# EAGLE design photonAlarm5 (EAGLE 7.5.0)
CNAME: photon
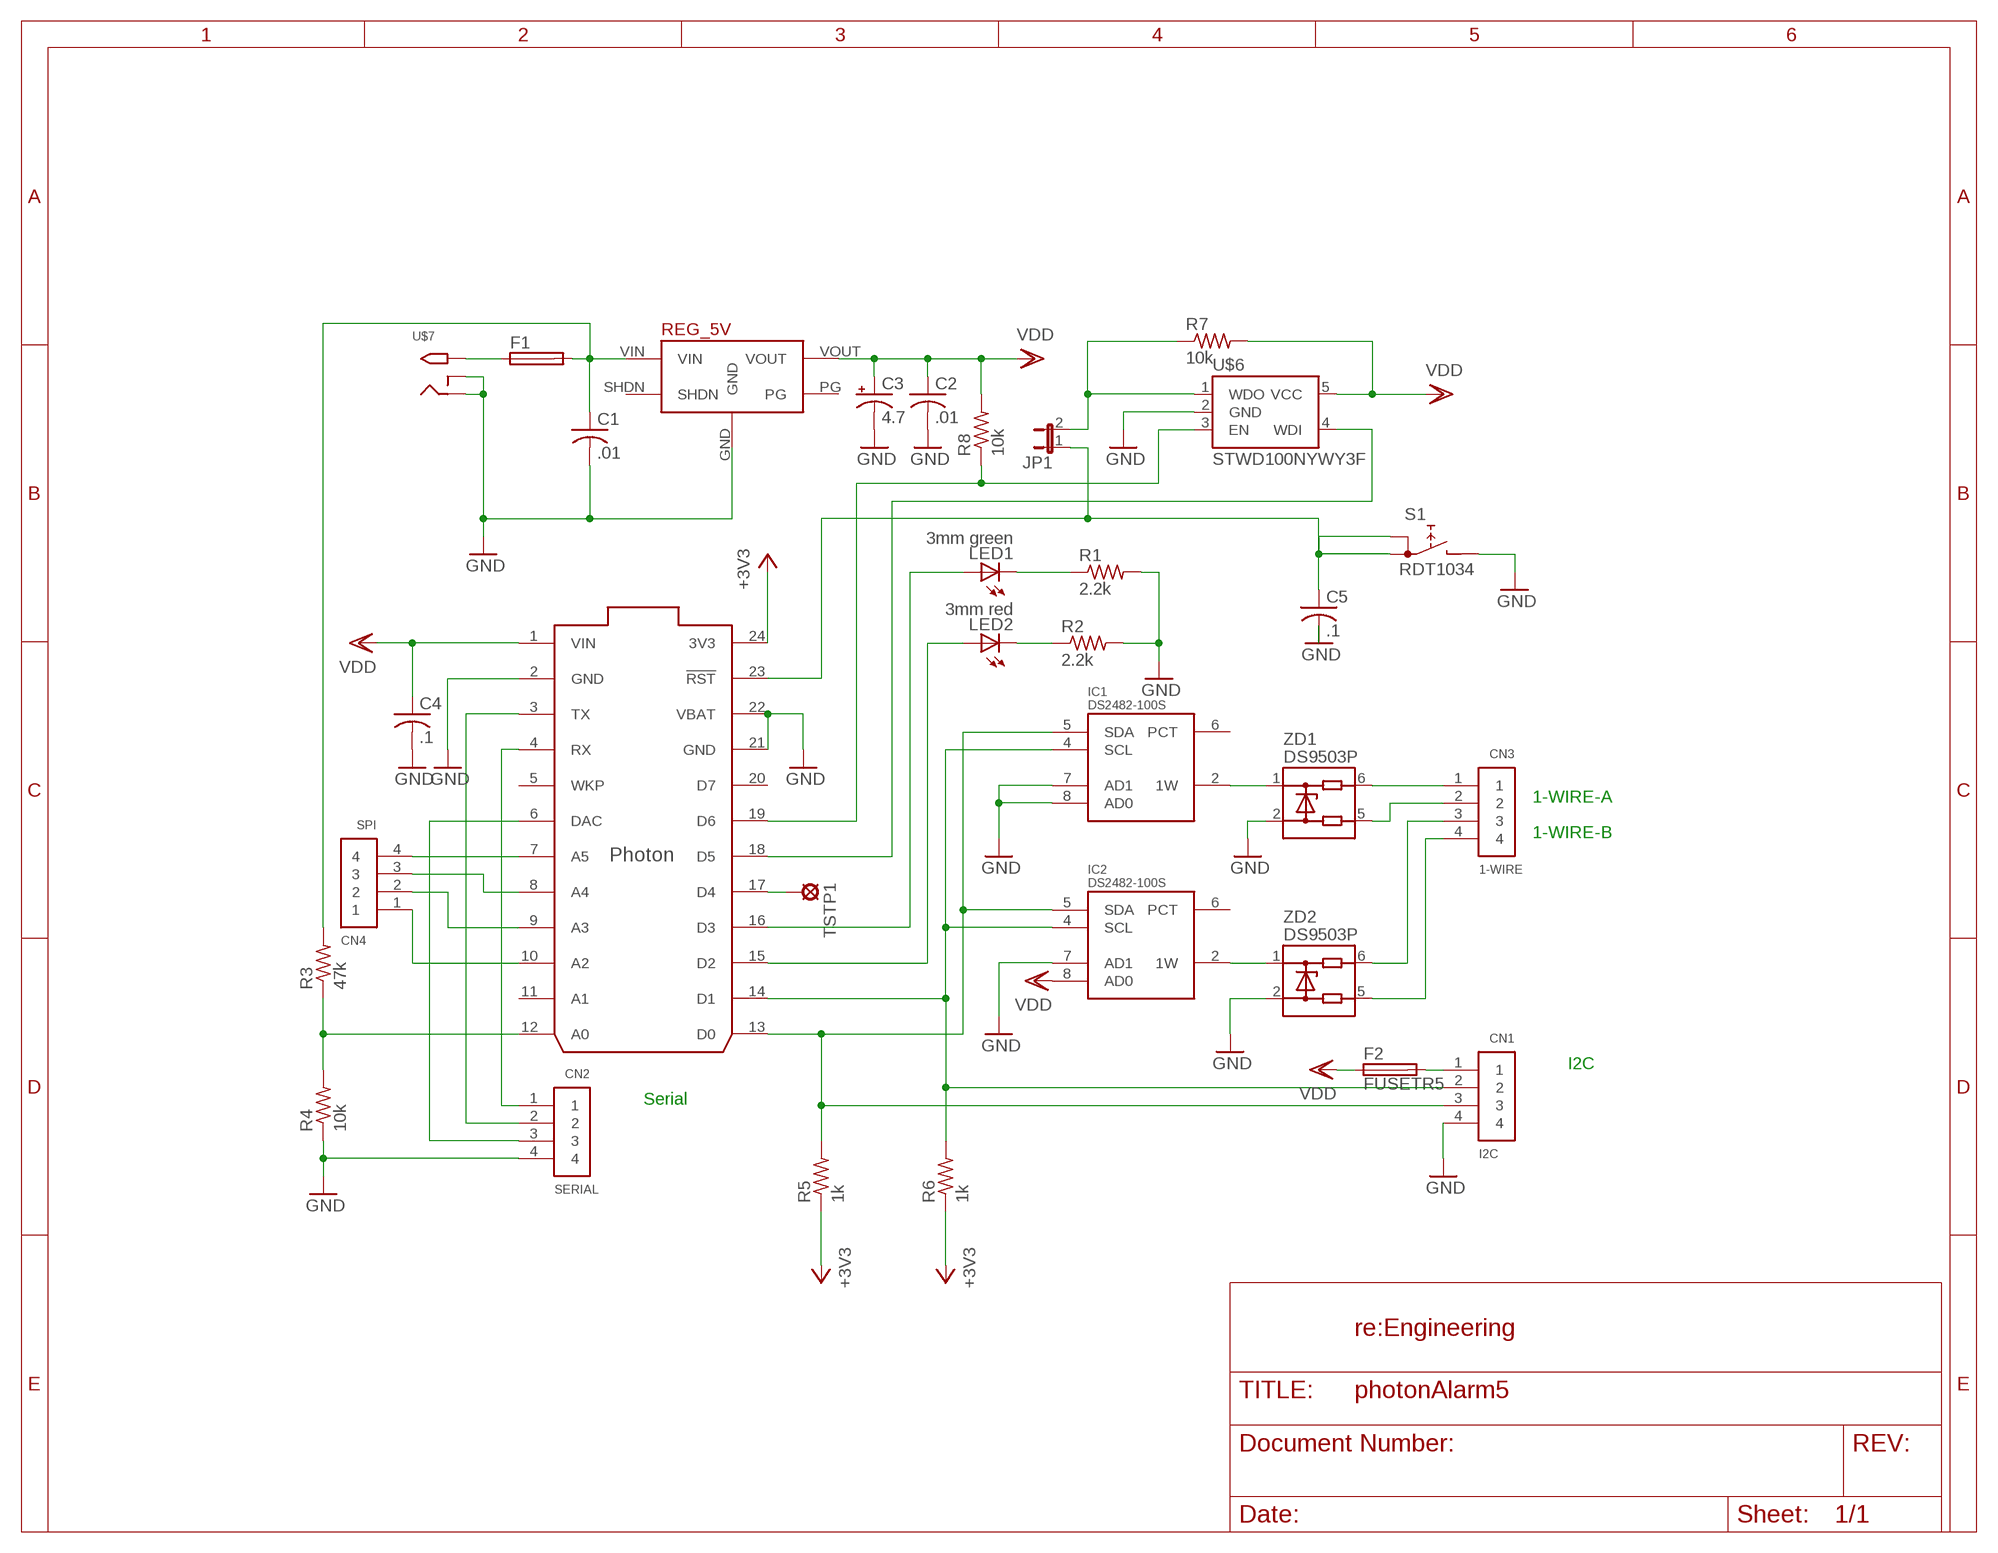
[diagram p0: schematic, sheet 1]

## Parts
C1  .01  C-USC0805  [C0805]
C2  .01  C-USC0805  [C0805]
C3  4.7  CPOL-USE2,5-6E  [E2,5-6E]
C4  .1  C-USC0805  [C0805]
C5  .1  C-USC0805  [C0805]
CN1  I2C  1X4-BIG  [1X04-BIG]
CN2  SERIAL  1X4-BIG  [1X04-BIG]
CN3  1-WIRE  1X4-BIG  [1X04-BIG]
CN4  SPI  1X4-BIG  [1X04-BIG]
F1  PICOFUSE  [PICOFUSE]
F2  FUSETR5  [TR5]
IC1  DS2482-100S  [SO08]
IC2  DS2482-100S  [SO08]
JP1  JP1E  [JP1]
LED1  3mm green  LED5MM  [LED5MM]
LED2  3mm red  LED5MM  [LED5MM]
R1  2.2k  R-US_R1206  [R1206]
R2  2.2k  R-US_R1206  [R1206]
R3  47k  R-US_R1206  [R1206]
R4  10k  R-US_R1206  [R1206]
R5  1k  R-US_R1206  [R1206]
R6  1k  R-US_R1206  [R1206]
R7  10k  R-US_R1206  [R1206]
R8  10k  R-US_R1206  [R1206]
REG_5V  5V_D24V10FAD24V10F5MIR  [5V_D24V10F5]
S1  RDT1034  [RDT1034]
TSTP1  LSP10  [LSP10]
U$1  PHOTON_WITH_HEADERS  [PHOTON]
U$6  STWD100NYWY3F  [SOT23-5]
U$7  2.1MMJACKSMT  [DCJACK_2MM_SMT]
ZD1  DS9503P  [TSOC6]
ZD2  DS9503P  [TSOC6]

## Nets
+3V3: R5.1 R6.1 U$1.24(3V3)
GND: C1.2 C2.2 C3.- C4.2 C5.2 CN1.4 CN2.4 IC1.7(AD1) IC1.8(AD0) IC2.7(AD1) R1.2 R2.2 R4.1 REG_5V.GND S1.B U$1.2(GND) U$1.21(GND) U$1.22(VBAT) U$6.2(GND) U$7.GND(RING) U$7.GNDBREAK(RING_SW) ZD1.2 ZD2.2
N$1: TSTP1.MP U$1.17(D4)
N$2: CN1.2 IC1.4(SCL) IC2.4(SCL) R6.2 U$1.14(D1)
N$3: LED1.K(C) R1.1
N$4: LED2.K(C) R2.1
N$5: LED1.A U$1.16(D3)
N$6: LED2.A U$1.15(D2)
N$7: CN1.3 IC1.5(SDA) IC2.5(SDA) R5.2 U$1.13(D0)
N$8: IC1.2(1W) ZD1.1
N$10: R3.1 R4.2 U$1.12(A0)
N$11: IC2.2(1W) ZD2.1
N$12: CN3.3 ZD2.6
N$13: CN3.4 ZD2.5
N$14: CN3.2 ZD1.5
N$15: CN3.1 ZD1.6
N$16: CN2.1 U$1.4(RX)
N$17: CN2.2 U$1.3(TX)
N$18: CN2.3 U$1.6(DAC)
N$20: U$1.18(D5) U$6.4(WDI)
N$21: R8.1 U$1.19(D6) U$6.3(EN)
N$22: CN1.1 F2.2
N$23: CN4.4 U$1.7(A5)
N$24: CN4.3 U$1.8(A4)
N$25: F1.1 U$7.PWR2(TIP)
N$26: CN4.2 U$1.9(A3)
N$27: CN4.1 U$1.10(A2)
N$28: JP1.2 R7.1 U$6.1(WDO)
RST: C5.1 JP1.1 S1.A S1.A1 U$1.23(!RST)
VDD: C2.1 C3.+ C4.1 F2.1 IC2.8(AD0) R7.2 R8.2 REG_5V.VOUT U$1.1(VIN) U$6.5(VCC)
VIN: C1.1 F1.2 R3.2 REG_5V.VIN
Unconnected: IC1.6(PCT) IC2.6(PCT) REG_5V.PG REG_5V.SHDN U$1.5(WKP) U$1.11(A1) U$1.20(D7)

## Notes on the sheet
- 1-WIRE-A
- 1-WIRE-B
- I2C
- Serial
- re:Engineering

## Power pins joined to a net without a drawn wire
GND: IC1.3(GND) IC2.3(GND)
VDD: IC1.1(VDD) IC2.1(VDD)

## Library data of the parts
C1 C2 C4 C5 = adafruit:C-US: CAPACITOR, American symbol
C3 = rcl:CPOL-US: POLARIZED CAPACITOR, American symbol
CN1-CN4 = adafruit:1X4: 4-pin connector
F1 = dont:PICOFUSE: PICOFUSE 19275, Wickmann; OC_FARNELL: unknown; OC_NEWARK: unknown
F2 = fuse:FUSE: Fuse; OC_FARNELL: unknown; OC_NEWARK: unknown
IC1 IC2 = 1wire:DS2482-100: I2C to 1-Wire Host Adapter/Line Driver This device is a onewire host and I2C interface in one chip. It provides the complete DC/AC requirements for onewire communication, including overdrive speed mode, but, unlike the DS2480B chip, no 12V EPROM programming. Notes: For overdrive speed and 5V EEPROM programming, an external active pullup circuit must be connected to the 1W, VDD and PCT pin. See the datasheet for details. The lower two I2C adress bits of the chip can be selected by external pins, so up to 4 chips may be connected to the same I2C bus. Author: Orginal device and description from Giovanni Varasano <giovanni.varasano@fastwebnet.it> Improved by Jan Kandziora <jjj@gmx.de>
JP1 = jumper:JP1E: JUMPER
LED1 LED2 = adafruit:LED: LED OSRAM: - CHIPLED LG R971, LG N971, LY N971, LG Q971, LY Q971, LO R971, LY R971 LH N974, LH R974 LS Q976, LO Q976, LY Q976 LO Q996 - Hyper CHIPLED LW Q18S LB Q993, LB Q99A, LB R99A - SideLED LS A670, LO A670, LY A670, LG A670, LP A670 LB A673, LV A673, LT A673, LW A673 LH A674 LY A675 LS A676, LA A676, LO A676, LY A676, LW A676 LS A679, LY A679, LG A679 - Hyper Micro SIDELED® LS Y876, LA Y876, LO Y876, LY Y876 LT Y87S - SmartLED LW L88C, LW L88S LB L89C, LB L89S, LG L890 LS L89K, LO L89K, LY L89K LS L896, LA L896, LO L896, LY L896 - TOPLED LS T670, LO T670, LY T670, LG T670, LP T670 LSG T670, LSP T670, LSY T670, LOP T670, LYG T670 LG T671, LOG T671, LSG T671 LB T673, LV T673, LT T673, LW T673 LH T674 LS T676, LA T676, LO T676, LY T676, LB T676, LH T676, LSB T676, LW T676 LB T67C, LV T67C, LT T67C, LS T67K, LO T67K, LY T67K, LW E67C LS E67B, LA E67B, LO E67B, LY E67B, LB E67C, LV E67C, LT E67C LW T67C LS T679, LY T679, LG T679 LS T770, LO T770, LY T770, LG T770, LP T770 LB T773, LV T773, LT T773, LW T773 LH T774 LS E675, LA E675, LY E675, LS T675 LS T776, LA T776, LO T776, LY T776, LB T776 LHGB T686 LT T68C, LB T68C - Hyper Mini TOPLED® LB M676 - Mini TOPLED Santana® LG M470 LS M47K, LO M47K, LY M47K Source: http://www.osram.convergy.de/
R1-R8 = resistor:R-US_: RESISTOR, American symbol
REG_5V = reEng:5V_D24V10FA
S1 = switch:RDT1034: PUSH SWITCH www.radiohm.com
TSTP1 = solpad:LSP10: SOLDER PAD drill 1.0 mm, distributor Buerklin, 12H555
U$1 = Spark:PHOTON
U$6 = reEng:STWD100NYWY3F: STD100 STWD100NYWY3F Watchdog Timer
U$7 = adafruit:2.1MMJACK: 2.1mm x 5.5mm THM DC jack with internal switch. Digikey part #PJ-102A, 4UCON part #05537 2.1mm x 5.5mm SMT DC jack with internal switch. Digikey part #PJ-002A-SMT, 4UCON part #03267 By microbuilder.eu & adafruit.com
ZD1 ZD2 = 1wire:DS9503: ESD Protection Diode with Resistors This ESD protection diode is designed especially for onewire host interfaces. Unlike the DS9502, it has two additional 5Ohm resitors in the 1W and GND line. Pin 5 and 6 have to be connected to the host side, pin 1 und 2 to the network side. The 1W line is through pin 1 and 6, the GND line is through pin 2 and 5. Author: Jan Kandziora <jjj@gmx.de>

## Board
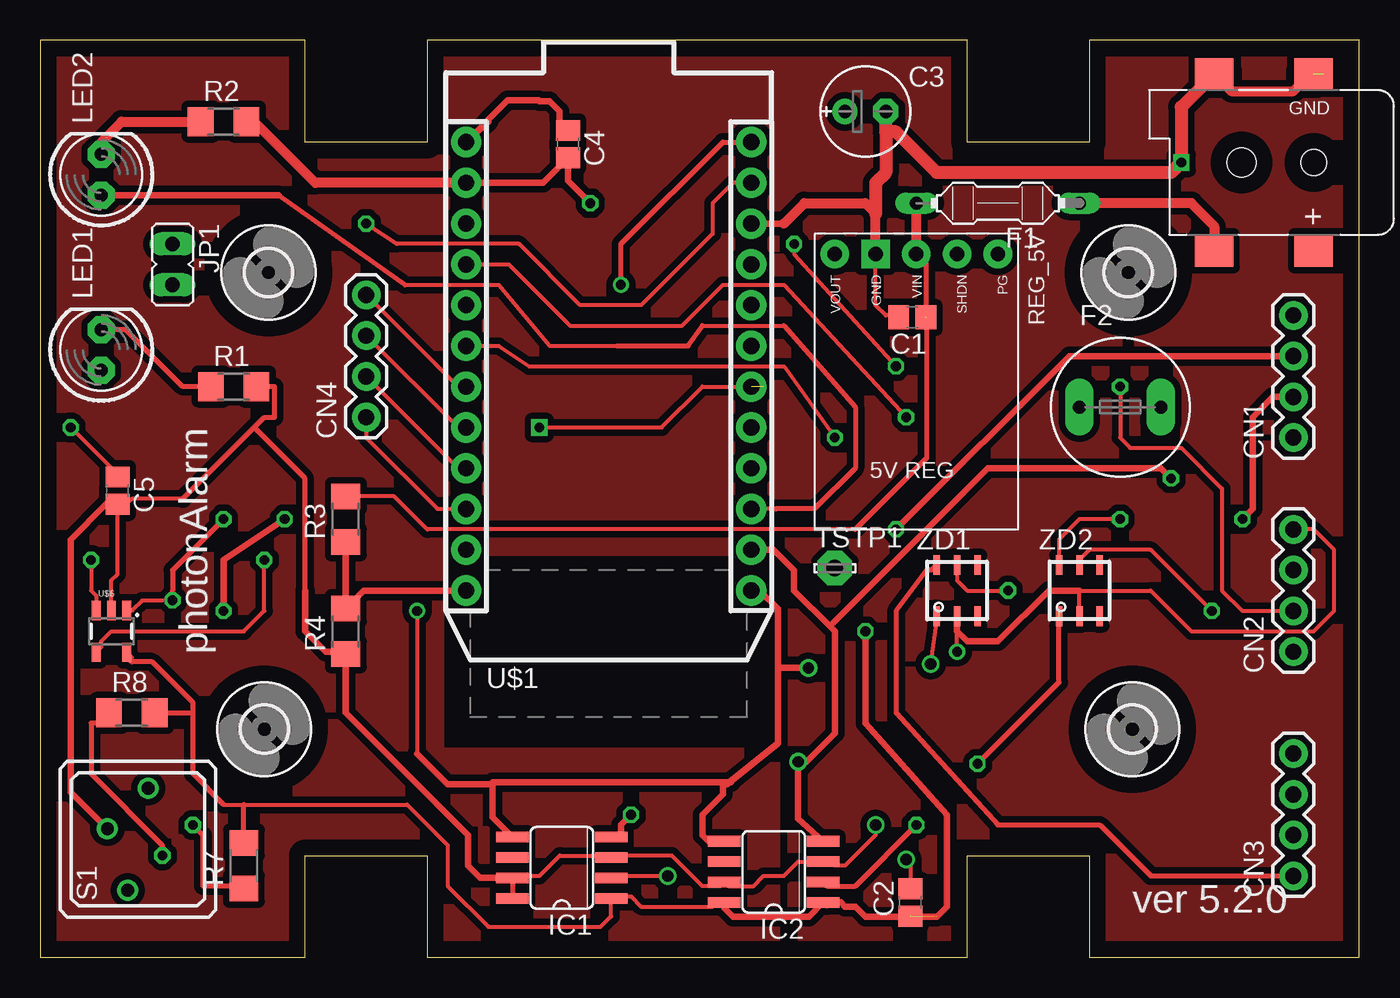
[diagram p1: board, top side]
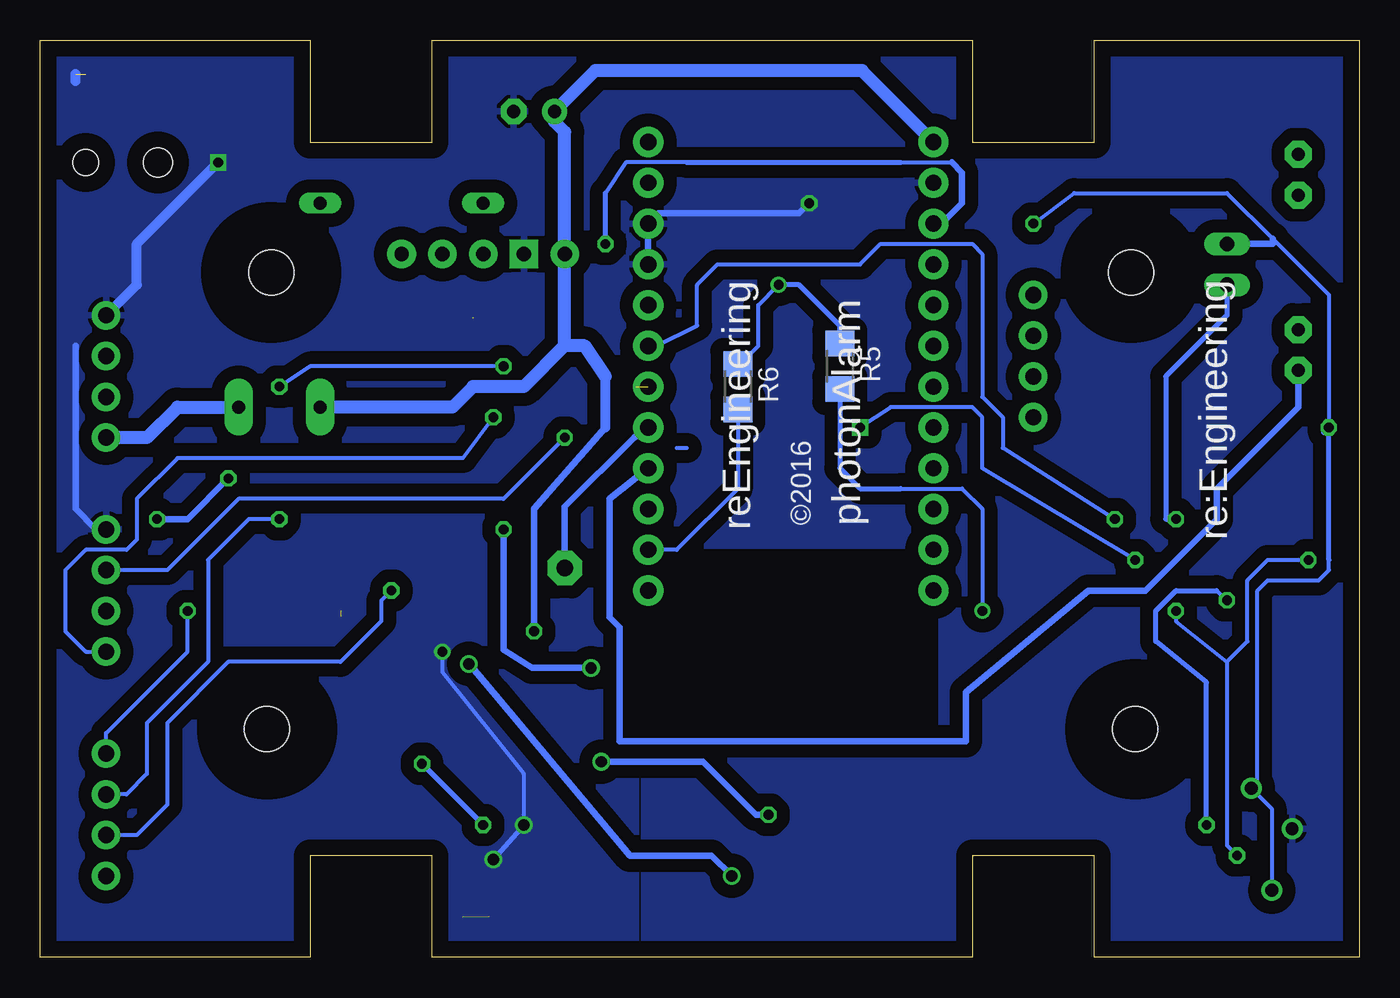
[diagram p2: board, bottom side, seen from below]

Size 82.22 x 57.15 mm. Coordinates in mm from the lower left corner, seen from the top.
Outline: 0,0 16.51,0 16.51,6.35 24.13,6.35 24.13,0 57.78,0 57.78,6.35 65.41,6.35 65.41,0 82.22,0 82.22,57.14 65.41,57.14 65.41,50.8 57.78,50.8 57.78,57.15 24.13,57.15 24.13,50.8 16.51,50.8 16.51,57.14 0,57.14 0,0
Copper layers (1*16): Top 0.035mm / dielectric 1.5mm / Bottom 0.035mm
Design rules "default *": minimum track width 10mil, minimum drill 12mil, track to track 8mil, track to pad 8mil, pad to pad 8mil, via to via 8mil, smd to smd 8mil, copper to edge 40mil, drill to drill 8mil, minimum pad ring 10mil, minimum via ring 8mil, stop-mask expansion 4mil, vias tented up to drill 0mil, thermal gap 10mil

### Footprints (pad centres in the part's own frame; a part is rotated, then mirrored left to right if it is on the bottom)
C0805 = smd 1.3 x 1.5: 1 -0.85,0; 2 0.85,0
E2,5-6E = drill 0.813 pad 1.575: + -1.27,0 | drill 0.813 pad 1.575 octagon: - 1.27,0
1X04-BIG = drill 1.016 pad 1.778: 1 0,0; 2 2.54,0; 3 5.08,0; 4 7.62,0
PICOFUSE = drill 0.813 long: 1 -5.08,0; 2 5.08,0
TR5 = drill 0.813 pad 1.778 long: 1 -2.54,0; 2 2.54,0
SO08 = smd 0.66 x 2.032: 1 -1.905,-3.073; 2 -0.635,-3.073; 3 0.635,-3.073; 4 1.905,-3.073; 5 1.905,3.073; 6 0.635,3.073; 7 -0.635,3.073; 8 -1.905,3.073
JP1 = drill 0.914 long: 1 0,-1.27; 2 0,1.27
LED5MM = drill 0.813 pad 1.676 octagon: A -1.27,0; K 1.27,0
R1206 = smd 1.6 x 1.803: 1 -1.422,0; 2 1.422,0
5V_D24V10F5 = drill 0.9 pad 1.778 square: GND 2.54,-10.16 | drill 0.9 pad 1.778: PG -5.08,-10.16; SHDN -2.54,-10.16; VIN 0,-10.16; VOUT 5.08,-10.16
RDT1034 = drill 0.8: A 3.175,-0.635; A1 -3.175,0.635; B 0.65,1.9
LSP10 = drill 1.016 pad 2.159 octagon: MP 0,0
PHOTON = drill 1.016 pad 1.88: 1 1.27,32.258; 2 1.27,29.718; 3 1.27,27.178; 4 1.27,24.638; 5 1.27,22.098; 6 1.27,19.558; 7 1.27,17.018; 8 1.27,14.478; 9 1.27,11.938; 10 1.27,9.398; 11 1.27,6.858; 12 1.27,4.318; 13 19.05,4.318; 14 19.05,6.858; 15 19.05,9.398; 16 19.05,11.938; 17 19.05,14.478; 18 19.05,17.018; 19 19.05,19.558; 20 19.05,22.098; 21 19.05,24.638; 22 19.05,27.178; 23 19.05,29.718; 24 19.05,32.258
2,8 = hole 2.8: 0,0
SOT23-5 = smd 0.55 x 1.2: 1 0.95,1.3; 2 0,1.3; 3 -0.95,1.3; 4 -0.95,-1.3; 5 0.95,-1.3
DCJACK_2MM_SMT = smd 2.4 x 2: GND 0,-5.5; GNDBREAK 6.2,-5.5; PWR1 0,5.5; PWR2 6.2,5.5 | hole 1.6: 0,0 | hole 1.8: 4.5,0
TSOC6 = smd 0.406 x 1.219: 1 -1.27,-1.6; 2 0,-1.6; 3 1.27,-1.6; 4 1.27,1.6; 5 0,1.6; 6 -1.27,1.6

### Placement (x,y rotation side)
C1  54.36,39.88 180 top
C2  54.23,3.43 90 top
C3  51.44,52.7 0 top
C4  32.89,50.67 270 top
C5  4.83,29.08 270 top
CN1  78.11,32.38 90 top
CN2  78.11,19.05 90 top
CN3  78.11,5.08 90 top
CN4  20.32,33.66 90 top
F1  59.69,46.99 180 top
F2  67.31,34.29 0 top
IC1  32.51,5.59 90 top
IC2  45.72,5.33 90 top
JP1  8.26,43.18 180 top
LED1  3.81,37.85 90 top
LED2  3.81,48.77 90 top
R1  12.06,35.56 0 top
R2  11.43,52.07 0 top
R3  19.05,27.3 90 top
R4  19.05,20.32 90 top
R5  32.38,36.83 270 bottom
R6  38.73,35.56 270 bottom
R7  12.7,5.71 90 top
R8  5.71,15.24 0 top
REG_5V  54.61,33.66 180 top
S1  6.1,7.37 90 top
TSTP1  49.53,24.26 0 top
U$1  25.27,18.54 0 top
U$2  [2,8]  14.22,42.67 0 top
U$3  [2,8]  13.97,14.22 0 top
U$4  [2,8]  67.82,42.67 0 top
U$5  [2,8]  68.07,14.22 0 top
U$6  4.45,20.32 0 top
U$7  79.38,49.53 180 top
ZD1  57.15,22.86 0 top
ZD2  64.77,22.86 0 top

### Tracks (layer width: path | path; a pad name or v marks a point on that pad's centre or on a via)
+3V3  (via drill 0.6)
  Top 0.305: v36.2,41.91 36.2,44.45 42.55,50.8 U$1.24
  Bottom 0.254: R6.1 38.73,36.83 37.47,38.1 37.47,40.64 v36.2,41.91
  Bottom 0.305: R5.1 32.38,39.37 34.92,41.91 v36.2,41.91
GND  (via drill 0.6, 0.7)  (1 unrouted)
  Top 0.254: v57.15,19.05 57.15,20.32 | U$6.2 4.45,23.5 4.83,23.88 C5.2 5.37,28.23 5.71,28.57 8.89,28.57 | C1.2 53.38,40.01 52.7,40.01 52.07,40.64 REG_5V.GND | IC1.7 29.57,5.08 31.11,5.08 32.38,6.35 34.92,6.35 35.05,6.22 IC1.3 36.07,6.22 36.2,6.35 39.37,6.35 41.27,4.45 42.39,4.45 IC2.7 42.9,4.45 44.45,4.45 45.09,5.08 46.35,5.08 47.24,5.97 IC2.3 49.28,5.97 49.53,5.71 50.16,5.71 52.07,7.62 v52.07,8.26 | v53.98,6.1 54.23,5.84 C2.2 | ZD2.2 64.77,22.86 69.22,22.86 71.75,20.32 79.38,20.32 80.64,21.59 80.64,25.4 79.38,26.67 CN2.4
  Top 0.305: IC1.7 IC1.8 | 16.51,22.86 16.51,29.84 13.34,33.02 | 8.89,28.57 13.34,33.02 | 13.34,33.02 13.97,33.66 14.61,33.66 14.61,35.56 R1.2
  Top 0.406: U$1.2 31.33,48.26 C4.2 32.89,48.39 v34.29,46.99 | 16.51,22.86 16.51,20.32 17.78,19.05 18.9,19.05 R4.1 19.05,15.24 26.67,7.62 26.67,5.71 27.43,4.95 IC1.7 | S1.B 1.91,10.31 1.91,26.04 4.1,28.23 C5.2 | U$1.22 46.35,45.72 | ZD1.2 57.15,20.32 57.78,19.68 59.69,19.68 62.87,22.86 64.77,22.86
  Top 0.61: U$1.2 17.14,48.26 13.34,52.07 R2.2 | 46.35,45.72 47.62,46.99 51.44,46.99 52.07,46.35 REG_5V.GND | U$7.GNDBREAK 74.23,53.98 78.11,53.98 78.74,54.61
  Top 0.813: U$7.GNDBREAK 71.12,52.98 v71.12,49.53 70.48,48.9 55.88,48.9 53.34,51.44 52.7,51.44 | 52.7,51.44 52.7,48.9 52.07,48.26 52.07,46.35 | 52.7,51.44 C3.-
  Bottom 0.254: v52.07,8.26 52.07,11.43 57.15,17.78 v57.15,19.05 | 44.45,45.72 U$1.22
  Bottom 0.305: v52.07,8.26 v53.98,6.1
  Bottom 0.406: 80.01,38.1 80.01,27.94 78.74,26.67 | U$1.21 U$1.22 43.69,46.35 34.92,46.35 v34.29,46.99
  Bottom 0.61: 80.01,54.61 80.01,55.03 | CN1.4 76.2,41.91 76.2,44.45 v71.12,49.53
  pour Bottom (isolate 0.813): 0.76,56.64 16.51,56.64 16.51,50.16 24.13,50.16 24.13,56.52 57.15,56.52 57.15,50.16 66.04,50.16 66.04,56.64 81.79,56.64 81.79,0.51 66.04,0.64 66.04,6.99 57.78,6.99 57.78,0.25 45.09,0.25 45.09,25.65 26.04,25.65 26.04,13.72 44.58,13.72 44.58,0.25 24.13,0 24.13,6.99 16.51,6.99 16.51,0.25 0.51,0.25
N$1
  Bottom 0.406: U$1.17 45.21,32.38 49.53,28.07 TSTP1.MP
N$2  (via drill 0.6, 0.7)
  Top 0.406: IC2.4 47.5,8.38 47.24,8.64 v47.24,12.19 47.75,12.19 49.53,13.97 49.53,20.32 49.21,20.64 | v36.83,8.89 36.2,8.26 36.2,7.62 36.07,7.49 IC1.4 | 49.21,20.64 59.05,30.48 69.85,30.48 v70.48,29.84 | v74.93,27.3 75.56,27.94 75.56,33.66 76.83,34.92 CN1.2 | U$1.14 45.72,25.4 46.99,24.13 46.99,22.86 49.21,20.64
  Bottom 0.254: 38.73,34.29 R6.2 38.73,29.21 42.55,25.4 U$1.14
  Bottom 0.406: v47.24,12.19 40.89,12.19 37.59,8.89 v36.83,8.89 | v70.48,29.84 73.03,27.3 v74.93,27.3
N$3
  Top 0.305: R1.1 8.89,35.56 5.33,39.12 LED1.K
N$4
  Top 0.61: LED2.K 3.81,50.8 5.08,52.07 R2.1
N$5
  Bottom 0.406: U$1.16 46.74,28.57 46.74,21.21 46.1,20.57 46.1,13.46 24.51,13.46 24.51,16.51 16.89,22.86 13.34,22.86 8.89,27.3 8.89,29.21 3.81,34.29 LED1.A
N$6
  Top 0.254: 45.85,27.94 U$1.15 | 41.27,39.37 46.35,39.37 | 22.73,41.91 28.57,41.91 31.75,38.1 35.94,38.1
  Top 0.305: 35.94,38.1 40.39,38.1 41.27,39.37 | 46.35,39.37 50.8,34.29 50.8,30.48 48.26,27.94 45.85,27.94 | 14.86,47.5 22.73,41.91
  Top 0.406: LED2.A 14.86,47.5
N$7  (via drill 0.6, 0.7)
  Top 0.254: v23.5,21.59 23.5,12.7
  Top 0.406: 28.19,10.92 43.05,10.92 42.55,10.79 | 45.97,18.03 45.97,13.34 42.8,10.79 42.55,10.79 | 45.97,18.03 45.97,21.72 44.83,22.86 U$1.13 | v47.88,18.03 45.97,18.03 | 42.55,10.79 42.55,10.16 41.27,8.89 41.27,7.62 41.66,7.24 IC2.5 | v53.34,26.67 64.14,37.47 CN1.3 | IC1.5 28.19,8.74 28.19,10.92 | 28.19,10.92 28.07,10.79 25.4,10.79 23.5,12.7
  Bottom 0.254: 28.57,29.21 24.77,29.21 23.5,27.94 v23.5,21.59
  Bottom 0.305: 32.38,35.56 R5.2 32.38,30.48 31.11,29.21 28.57,29.21
  Bottom 0.406: v47.88,18.03 51.56,18.03 53.34,19.18 v53.34,26.67
N$8  (via drill 0.7)
  Top 0.254: ZD1.1 55.88,21.21 v55.5,18.29 | IC1.2 35.71,5.08 v39.12,5.08
  Bottom 0.406: v55.5,18.29 53.98,16.51 45.47,6.35 40.39,6.35 v39.12,5.08
N$9
  Bottom 0.254: 42.55,31.75 41.91,31.75
N$10
  Top 0.406: R3.1 R4.2 20.17,22.86 U$1.12
N$11  (via drill 0.6)  (1 unrouted)
  Top 0.305: IC2.2 49.05,4.45 50.8,4.45 v54.61,8.26 | v58.42,12.06 63.5,17.14 63.5,21.59
  Bottom 0.305: v54.61,8.26 v58.42,12.06
N$12  (via drill 0.6)
  Top 0.254: v67.31,27.3 64.77,27.3 63.5,26.04 ZD2.6
  Bottom 0.254: v67.31,27.3 69.22,27.3 71.75,24.77 71.75,18.41 75.56,14.61 75.56,11.43 76.83,10.16 CN3.3
N$13  (via drill 0.6)
  Top 0.254: v73.03,21.59 69.22,25.4 65.41,25.4 64.77,24.77 ZD2.5
  Bottom 0.254: CN3.4 78.11,13.97 73.03,19.05 v73.03,21.59
N$14  (via drill 0.6)
  Top 0.254: ZD1.5 57.15,23.5 57.78,22.86 v60.33,22.86
  Bottom 0.254: v60.33,22.86 60.96,22.23 60.96,20.95 63.5,18.41 70.48,18.41 74.3,14.61 74.3,9.53 76.2,7.62 CN3.2
N$15
  Top 0.305: ZD1.6 55.55,24.13 55.24,24.13 53.34,21.59 53.34,15.24 59.69,8.26 66.04,8.26 69.22,5.08 CN3.1
N$16  (via drill 0.6)
  Top 0.254: U$1.4 29.21,43.18 33.02,39.37 40.01,39.37 42.55,41.91 46.35,41.91 v53.98,33.66
  Bottom 0.254: v53.98,33.66 55.88,31.11 73.66,31.11 76.2,28.57 76.2,26.04 76.83,25.4 79.38,25.4 80.64,24.13 80.64,20.32 79.38,19.05 CN2.1
N$17  (via drill 0.6)
  Top 0.254: v46.99,44.45 46.99,43.81 v53.34,36.83 | v67.31,35.56 67.31,32.38 67.94,31.75 71.12,31.75 73.66,29.21 73.66,22.86 74.93,21.59 CN2.2
  Bottom 0.254: v53.34,36.83 65.41,36.83 v67.31,35.56 | 28.57,49.53 25.4,49.53 | 41.91,49.53 45.72,49.53 46.99,47.62
  Bottom 0.305: v46.99,44.45 46.99,47.62 | 41.91,49.53 28.57,49.53
  Bottom 0.406: 25.4,49.53 24.77,48.9 24.77,46.99 26.04,45.72 U$1.3
N$18  (via drill 0.6)
  Top 0.254: U$1.6 28.57,38.1 30.48,36.83 46.35,36.83 v49.53,32.38
  Bottom 0.254: v49.53,32.38 53.34,28.57 69.85,28.57 74.3,24.13 CN2.3
N$19
  pour Top (isolate 0.406): 0.64,0 0.64,57.15 15.88,57.15 15.88,50.16 24.77,50.16 24.77,56.52 57.15,56.52 57.15,50.16 66.04,50.16 66.04,56.52 81.92,56.52 81.92,0.64 66.04,0.64 66.04,6.99 57.78,6.99 57.78,0.64 47.62,0.64 47.62,1.91 46.99,1.91 46.99,25.4 24.77,25.4 24.77,12.7 45.72,12.7 45.72,0.64 24.77,0.64 24.77,6.99 15.88,6.99 15.88,0
N$20  (via drill 0.6)  (1 unrouted)
  Top 0.254: U$6.4 3.81,19.34 3.81,19.68 4.45,20.32 12.7,20.32 13.97,21.59 v13.97,24.77 | v31.11,33.02 38.73,33.02 41.27,35.56 45.09,35.56
  Bottom 0.254: v13.97,24.77 23.5,30.48 23.5,33.66 24.13,34.29 29.21,34.29 v31.11,33.02
N$21  (via drill 0.6)
  Top 0.254: v7.62,6.35 7.65,6.38 | v3.17,24.77 3.17,22.86 3.5,22.54 U$6.3
  Top 0.305: R8.1 3.66,14.61 3.17,14.61 3.17,11.43 7.62,6.99 v7.62,6.35
  Top 0.406: v15.24,27.3 11.43,24.77 v11.43,21.59
  Bottom 0.254: U$1.19 43.81,38.1 41.27,39.37 41.27,41.91 40.01,43.18 31.11,43.18 29.84,44.45 24.13,44.45 23.5,43.81 23.5,34.92 22.23,33.66 22.23,31.75 v15.24,27.3 | v11.43,21.59 11.43,20.95 8.26,18.41 | 8.26,18.41 8.26,6.99 v7.62,6.35 | 8.26,18.41 6.99,19.68 6.99,23.5 5.71,24.77 v3.17,24.77
N$22
  Bottom 0.813: CN1.1 75.56,32.38 73.66,34.29 F2.2
N$23
  Top 0.254: CN4.4 26.04,35.56 U$1.7
N$24
  Top 0.254: CN4.3 26.04,33.02 U$1.8
N$25
  Top 0.61: F1.1 71.75,46.99 73.17,45.57 U$7.PWR2
N$26
  Top 0.254: CN4.2 26.04,30.48 U$1.9
N$27
  Top 0.254: CN4.1 20.32,32.38 24.77,27.94 U$1.10
N$28  (via drill 0.6)
  Top 0.254: U$6.1 5.75,21.62 6.35,22.23 7.59,22.23 v8.26,22.25 8.22,22.86 8.26,22.86
  Top 0.305: v11.43,27.3 8.26,24.13 8.26,22.86 | R7.1 12.55,4.45 10.16,4.45 10.16,7.62 v9.53,8.26
  Bottom 0.254: 8.89,22.86 8.29,22.25 v8.26,22.25
  Bottom 0.305: JP1.2 8.26,40.01 12.06,36.2 12.06,27.3 v11.43,27.3 | v9.53,8.26 9.53,17.14 12.7,19.68 12.7,21.59 11.43,22.86 8.89,22.86
RST  (via drill 0.6)
  Top 0.254: U$1.23 43.18,48.26 41.91,46.99 41.91,45.09 37.47,40.64 33.66,40.64 29.84,44.45 22.23,44.45 v20.32,45.72 | v1.91,33.02 4.83,30.1 C5.1
  Top 0.305: S1.A1 5.56,4.29
  Bottom 0.254: v20.32,45.72 17.78,47.62 8.26,47.62 5.4,44.77 1.91,41.27 v1.91,33.02 | S1.A1 5.46,9.27 S1.A 6.35,10.92 6.35,22.86 5.71,23.5 2.54,23.5 1.91,24.13 1.91,24.77
  Bottom 0.305: 2.22,32.7 v1.91,33.02 1.91,24.77
  Bottom 0.406: JP1.1 5.4,44.45 5.4,44.77
VDD  (via drill 0.6)  (1 unrouted)
  Top 0.254: U$6.5 5.71,18.7 | 11.43,9.53 12.7,9.53 22.86,9.53 25.4,6.99 25.4,4.45 27.94,1.91 34.92,1.91 35.59,2.56 IC1.1 35.71,3.81 36.83,3.81 37.47,3.17 41.91,3.17 42.16,3.43 IC2.8 | IC2.1 49.05,3.17
  Top 0.305: R7.2 12.7,9.53 | 11.43,9.53 9.53,11.43 9.53,15.24 | 9.53,15.24 9.53,15.88 6.99,18.41 5.71,18.41 5.39,18.73 U$6.5 | R8.2 9.53,15.24
  Top 0.406: 27.94,52.07 U$1.1 29.15,53.4 31.05,53.4 31.11,53.34 31.75,53.34 32.38,52.7 32.38,52.03 C4.1 | IC2.8 42.65,3.07 43.18,2.54 47.9,2.54 IC2.1 49.91,3.43 50.16,3.17 50.8,3.17 51.44,2.54 55.88,2.54 56.52,3.17 56.52,8.89 51.44,14.61 v51.44,20.32
  Bottom 0.406: v51.44,20.32 51.44,27.94 46.99,33.02
  Bottom 0.61: 46.99,33.02 46.99,36.2
  Bottom 0.813: 49.53,38.1 REG_5V.VOUT 49.53,51.44 50.16,52.07 C3.+ 47.62,55.24 30.99,55.24 U$1.1 | 46.99,36.2 48.26,38.1 49.53,38.1 | 49.53,38.1 52.07,35.56 55.24,35.56 56.52,34.29 F2.1
VIN  (1 unrouted)
  Top 0.254: 50.8,26.67 24.13,26.67 22.07,28.73 R3.2
  Top 0.305: 55.24,39.84 55.24,31.11 50.8,26.67 | REG_5V.VIN 55.21,43.22 C1.1
  Top 0.61: REG_5V.VIN F1.2

### Text on the board
tNames: photonAlarm | ver 5.2.0
bNames: photonAlarm | ©2016 | reEngineering | re:Engineering